# EAGLE design control (EAGLE 6.6.0)
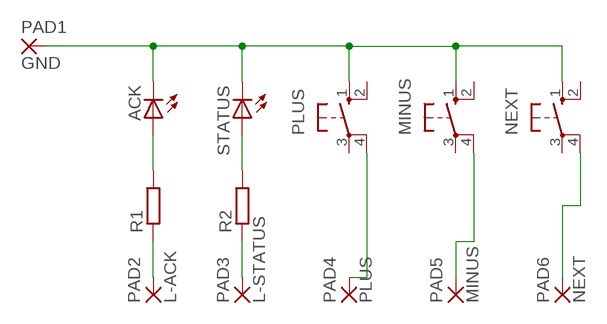
[diagram p0: schematic, sheet 1]

## Parts
ACK  LED3MM  [LED3MM]
MINUS  10-XX  [B3F-10XX]
NEXT  10-XX  [B3F-10XX]
PAD1  GND  SMD2  [SMD1,27-2,54]
PAD2  L-ACK  SMD2  [SMD1,27-2,54]
PAD3  L-STATUS  SMD2  [SMD1,27-2,54]
PAD4  PLUS  SMD2  [SMD1,27-2,54]
PAD5  MINUS  SMD2  [SMD1,27-2,54]
PAD6  NEXT  SMD2  [SMD1,27-2,54]
PLUS  10-XX  [B3F-10XX]
R1  R-EU_R0805  [R0805]
R2  R-EU_R0805  [R0805]
STATUS  LED3MM  [LED3MM]

## Nets
N$1: PAD2.1(P) R1.1
N$2: PAD3.1(P) R2.1
N$3: ACK.A R1.2
N$4: R2.2 STATUS.A
N$5: PAD4.1(P) PLUS.4(P1)
N$6: MINUS.4(P1) PAD5.1(P)
N$7: NEXT.4(P1) PAD6.1(P)
N$9: ACK.K(C) MINUS.1(S) NEXT.1(S) PAD1.1(P) PLUS.1(S) STATUS.K(C)
Unconnected: MINUS.2(S1) MINUS.3(P) NEXT.2(S1) NEXT.3(P) PLUS.2(S1) PLUS.3(P)

## Library data of the parts
ACK STATUS = led:LED: LED OSRAM: - CHIPLED LG R971, LG N971, LY N971, LG Q971, LY Q971, LO R971, LY R971 LH N974, LH R974 LS Q976, LO Q976, LY Q976 LO Q996 - Hyper CHIPLED LW Q18S LB Q993, LB Q99A, LB R99A - SideLED LS A670, LO A670, LY A670, LG A670, LP A670 LB A673, LV A673, LT A673, LW A673 LH A674 LY A675 LS A676, LA A676, LO A676, LY A676, LW A676 LS A679, LY A679, LG A679 - Hyper Micro SIDELED® LS Y876, LA Y876, LO Y876, LY Y876 LT Y87S - SmartLED LW L88C, LW L88S LB L89C, LB L89S, LG L890 LS L89K, LO L89K, LY L89K LS L896, LA L896, LO L896, LY L896 - TOPLED LS T670, LO T670, LY T670, LG T670, LP T670 LSG T670, LSP T670, LSY T670, LOP T670, LYG T670 LG T671, LOG T671, LSG T671 LB T673, LV T673, LT T673, LW T673 LH T674 LS T676, LA T676, LO T676, LY T676, LB T676, LH T676, LSB T676, LW T676 LB T67C, LV T67C, LT T67C, LS T67K, LO T67K, LY T67K, LW E67C LS E67B, LA E67B, LO E67B, LY E67B, LB E67C, LV E67C, LT E67C LW T67C LS T679, LY T679, LG T679 LS T770, LO T770, LY T770, LG T770, LP T770 LB T773, LV T773, LT T773, LW T773 LH T774 LS E675, LA E675, LY E675, LS T675 LS T776, LA T776, LO T776, LY T776, LB T776 LHGB T686 LT T68C, LB T68C - Hyper Mini TOPLED® LB M676 - Mini TOPLED Santana® LG M470 LS M47K, LO M47K, LY M47K Source: http://www.osram.convergy.de LUXEON: - LUMILED® LXK2-PW12-R00, LXK2-PW12-S00, LXK2-PW14-U00, LXK2-PW14-V00 LXK2-PM12-R00, LXK2-PM12-S00, LXK2-PM14-U00 LXK2-PE12-Q00, LXK2-PE12-R00, LXK2-PE12-S00, LXK2-PE14-T00, LXK2-PE14-U00 LXK2-PB12-K00, LXK2-PB12-L00, LXK2-PB12-M00, LXK2-PB14-N00, LXK2-PB14-P00, LXK2-PB14-Q00 LXK2-PR12-L00, LXK2-PR12-M00, LXK2-PR14-Q00, LXK2-PR14-R00 LXK2-PD12-Q00, LXK2-PD12-R00, LXK2-PD12-S00 LXK2-PH12-R00, LXK2-PH12-S00 LXK2-PL12-P00, LXK2-PL12-Q00, LXK2-PL12-R00 Source: www.luxeon.com KINGBRIGHT: KA-3528ASYC Source: www.kingbright.com
MINUS NEXT PLUS = buttons:10-XX: OMRON SWITCH
PAD1-PAD6 = wirepad:SMD2: SMD PAD
R1 R2 = resistor:R-EU_: RESISTOR, European symbol

## Board
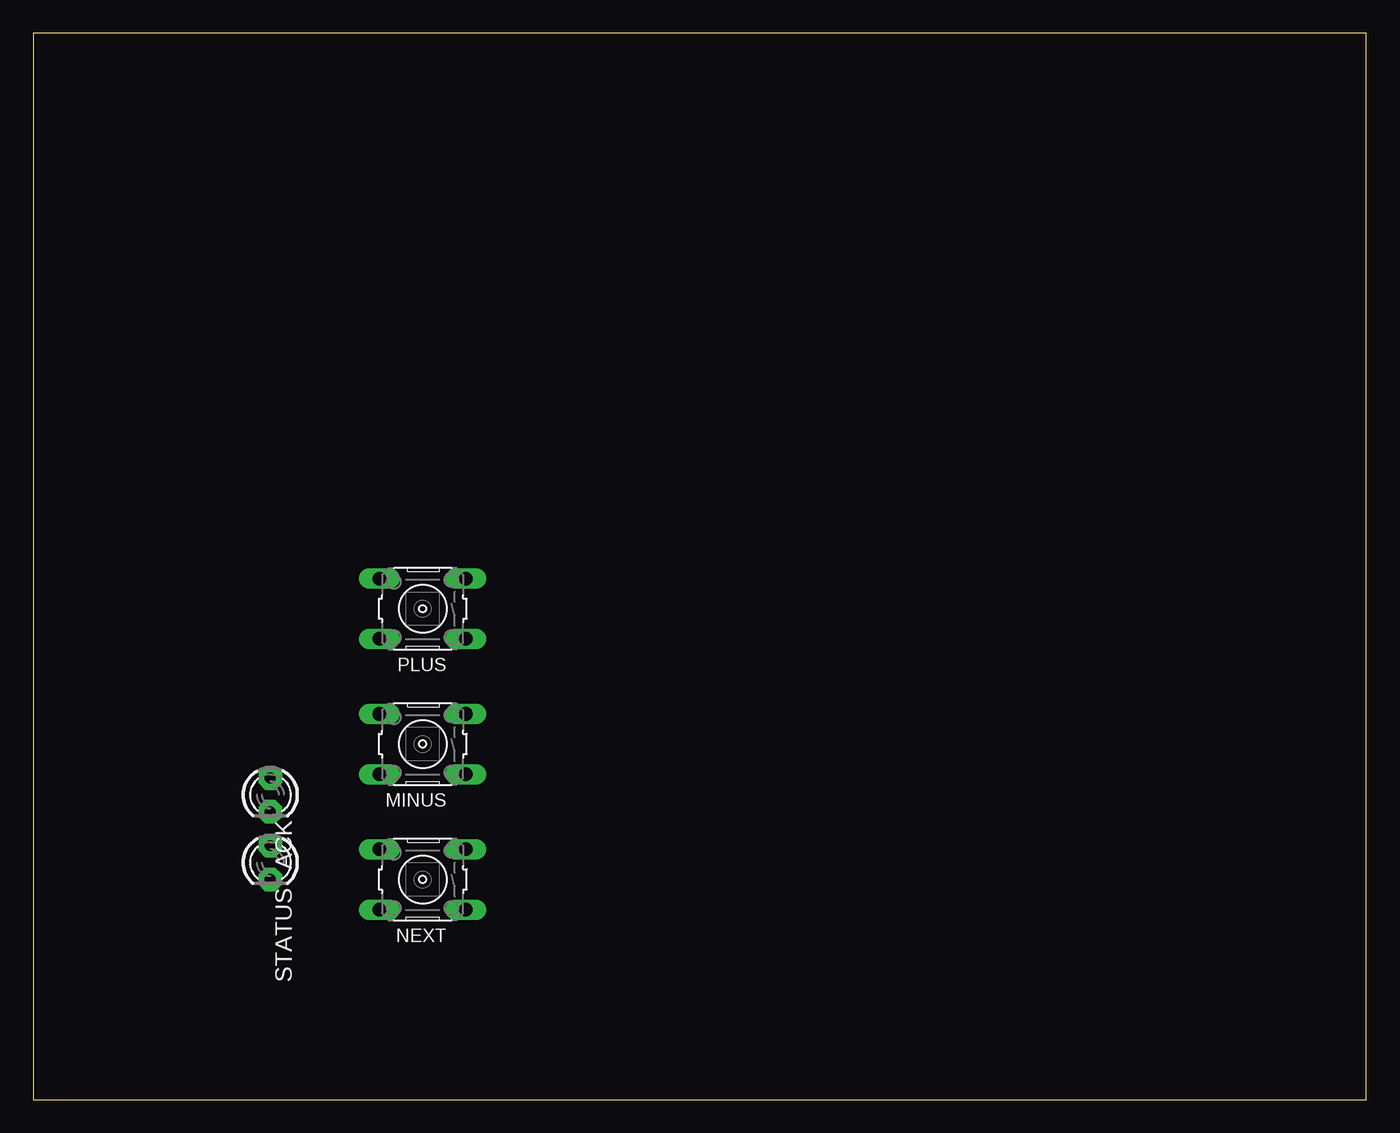
[diagram p1: board, top side]
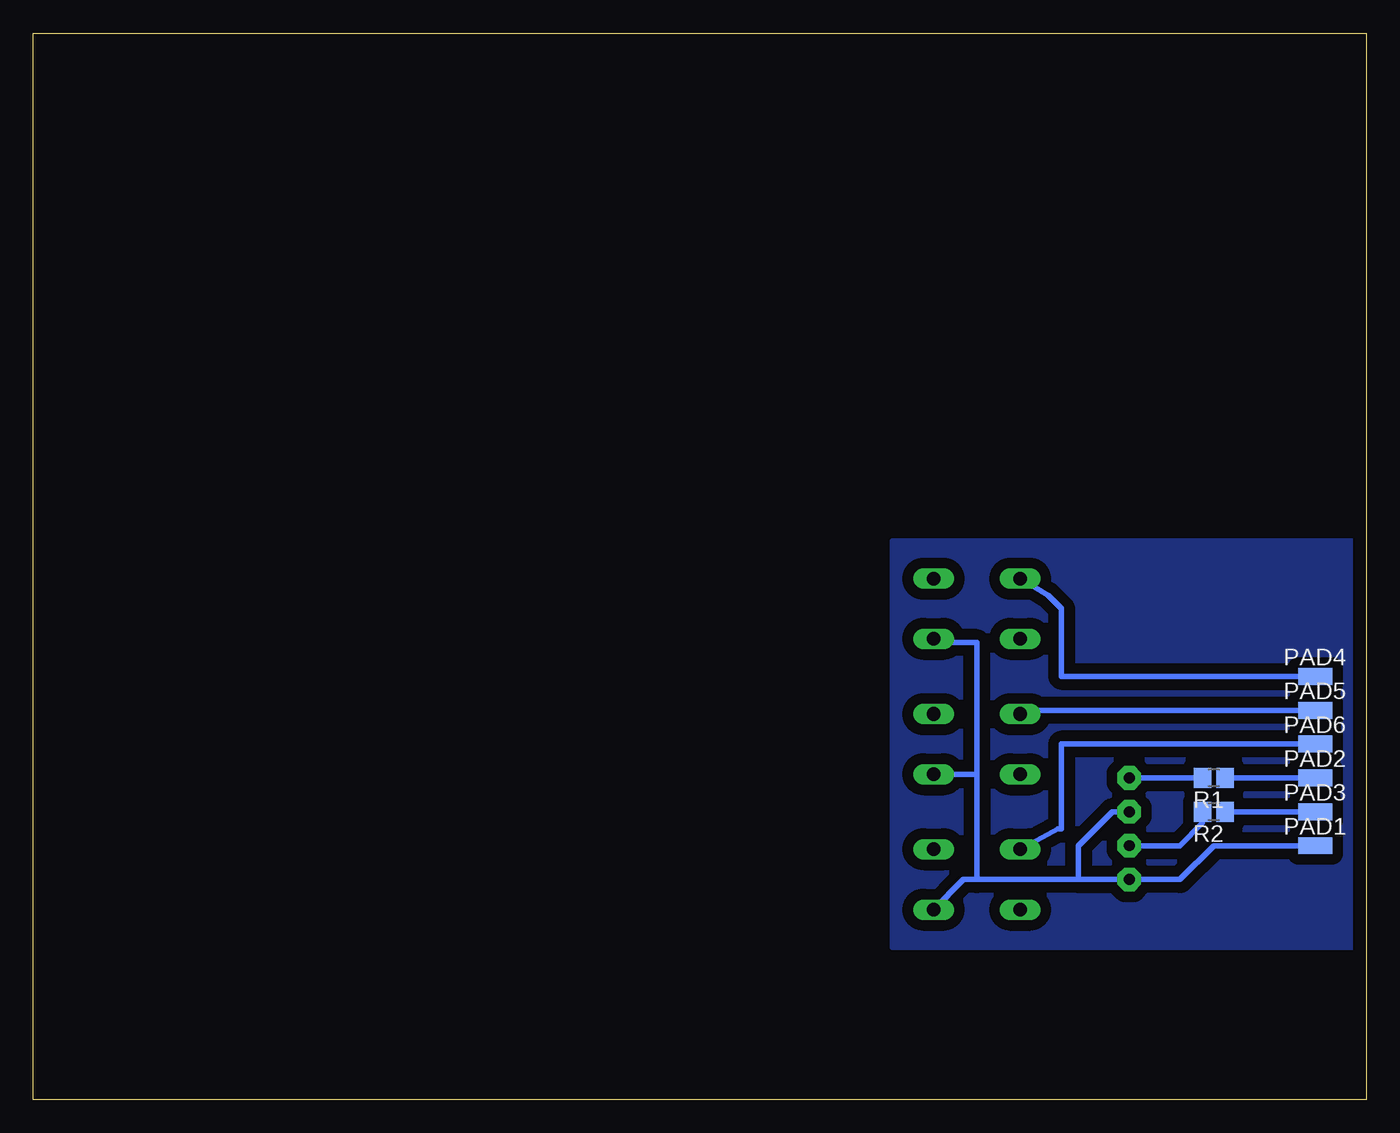
[diagram p2: board, bottom side, seen from below]

Size 100 x 80 mm. Coordinates in mm from the lower left corner, seen from the top.
Outline: 0,0 100,0 100,80 0,80 0,0
Copper layers (1*16): Top 0.035mm / dielectric 1.5mm / Bottom 0.035mm
Design rules "default": minimum track width 10mil, minimum drill 24mil, track to track 8mil, track to pad 8mil, pad to pad 8mil, via to via 8mil, smd to smd 8mil, copper to edge 40mil, drill to drill 8mil, minimum pad ring 10mil, minimum via ring 8mil, stop-mask expansion 4mil, vias tented up to drill 0mil, thermal gap 10mil

### Footprints (pad centres in the part's own frame; a part is rotated, then mirrored left to right if it is on the bottom)
LED3MM = drill 0.813 pad 1.778 octagon: A -1.27,0; K 1.27,0
B3F-10XX = drill 1.016 long: 1 -3.251,2.261; 2 3.251,2.261; 3 -3.251,-2.261; 4 3.251,-2.261
SMD1,27-2,54 = smd 1.27 x 2.54: 1 0,0
R0805 = smd 1.3 x 1.5: 1 -0.85,0; 2 0.85,0

### Placement (x,y rotation side)
ACK  17.78,22.86 270 top
MINUS  29.21,26.67 180 top
NEXT  29.21,16.51 180 top
PAD1  3.81,19.05 270 bottom
PAD2  3.81,24.13 270 bottom
PAD3  3.81,21.59 270 bottom
PAD4  3.81,31.75 270 bottom
PAD5  3.81,29.21 270 bottom
PAD6  3.81,26.67 270 bottom
PLUS  29.21,36.83 180 top
R1  11.43,24.13 180 bottom
R2  11.43,21.59 180 bottom
STATUS  17.78,17.78 270 top

### Tracks (layer width: path | path; a pad name or v marks a point on that pad's centre or on a via)
N$1
  Bottom 0.406: PAD2.1 R1.1
N$2
  Bottom 0.406: PAD3.1 R2.1
N$3
  Bottom 0.406: R1.2 ACK.A
N$4
  Bottom 0.406: R2.2 12.28,20.74 13.97,19.05 STATUS.A
N$5
  Bottom 0.406: PLUS.4 23.85,37.82 22.86,36.83 22.86,31.75 PAD4.1
N$6
  Bottom 0.406: PAD5.1 25.68,29.21 MINUS.4
N$7
  Bottom 0.406: PAD6.1 22.86,26.67 22.86,20.32 23.14,20.32 NEXT.4
N$8
  pour Bottom (isolate 0.813): 0,41.91 35.56,41.91 35.56,11.43 0,11.43
N$9
  Bottom 0.406: PAD1.1 11.43,19.05 13.97,16.51 STATUS.K | 32.03,34.57 PLUS.1 32.46,34.29 29.21,34.29 29.21,24.41 | ACK.K 19.05,21.59 21.59,19.05 21.59,16.51 STATUS.K | STATUS.K 29.21,16.51 | 29.21,16.51 30.2,16.51 NEXT.1 | 29.21,24.41 29.21,16.51 | MINUS.1 29.21,24.41